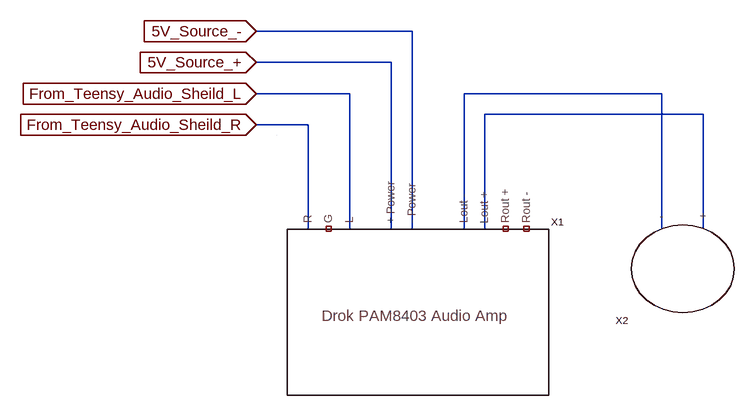
[diagram p0: schematic Audio_AMP_With_Speaker.asc]
Audio_AMP_With_Speaker.asc, the LTspice schematic file:
Version 4
SHEET 1 880 680
WIRE 208 -160 -32 -160
WIRE 176 -112 -32 -112
WIRE 112 -64 -32 -64
WIRE 592 -64 288 -64
WIRE 656 -32 320 -32
WIRE 48 -16 -32 -16
WIRE 48 144 48 -16
WIRE 112 144 112 -64
WIRE 176 144 176 -112
WIRE 208 144 208 -160
WIRE 288 144 288 -64
WIRE 320 144 320 -32
WIRE 592 144 592 -64
WIRE 656 144 656 -32
WIRE 0 0 0 0
FLAG -32 -64 From_Teensy_Audio_Sheild_L
IOPIN -32 -64 In
FLAG -32 -16 From_Teensy_Audio_Sheild_R
IOPIN -32 -16 In
FLAG -32 -112 5V_Source_+
IOPIN -32 -112 In
FLAG -32 -160 5V_Source_-
IOPIN -32 -160 In
SYMBOL Audio_Amplifier 192 320 R0
SYMATTR InstName X1
SYMBOL Speaker 560 160 R180
SYMATTR InstName X2

The netlist it stands for:
* Audio_AMP_With_Speaker.asc
XX1 From_Teensy_Audio_Sheild_R NC_01 From_Teensy_Audio_Sheild_L 5V_Source_+ 5V_Source_- N001 N002 NC_02 NC_03 Audio_Amplifier  ; pins R G L +_Power -_Power Lout_- Lout_+ Rout_+ Rout_-
XX2 N002 N001 Speaker  ; pins + -
.backanno
.end